# Altium project att.PrjPcb
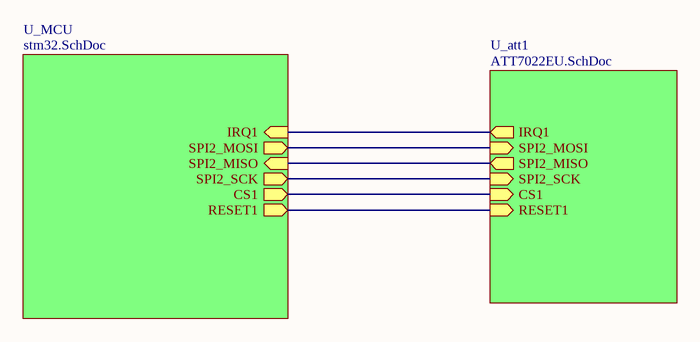
[diagram p0: maseter.SchDoc]
3 sheets, 58 parts. Net scope: hierarchical (ports join the sheet entries above them; power ports are global).
Board file: PCB1.PcbDoc
Sheets:
  maseter.SchDoc
    U_MCU = stm32.SchDoc
    U_att1 = ATT7022EU.SchDoc

## Sheet maseter.SchDoc
size A4

### Sub-sheets
U_att1 = ATT7022EU.SchDoc: IRQ1 (out), SPI2_MOSI (in), SPI2_MISO (out), SPI2_SCK (in), CS1 (in), RESET1 (in)
U_MCU = stm32.SchDoc: SPI2_MOSI (out), SPI2_SCK (out), RESET1 (out), SPI2_MISO (in), IRQ1 (in), CS1 (out)

### Nets
CS2: sheet U_MCU/CS1, sheet U_att1/CS1
DIN: sheet U_MCU/SPI2_MOSI, sheet U_att1/SPI2_MOSI
DOUT: sheet U_MCU/SPI2_MISO, sheet U_att1/SPI2_MISO
IRQ1: sheet U_MCU/IRQ1, sheet U_att1/IRQ1
RESET1: sheet U_MCU/RESET1, sheet U_att1/RESET1
SCLK: sheet U_MCU/SPI2_SCK, sheet U_att1/SPI2_SCK

## Sheet stm32.SchDoc
size A4
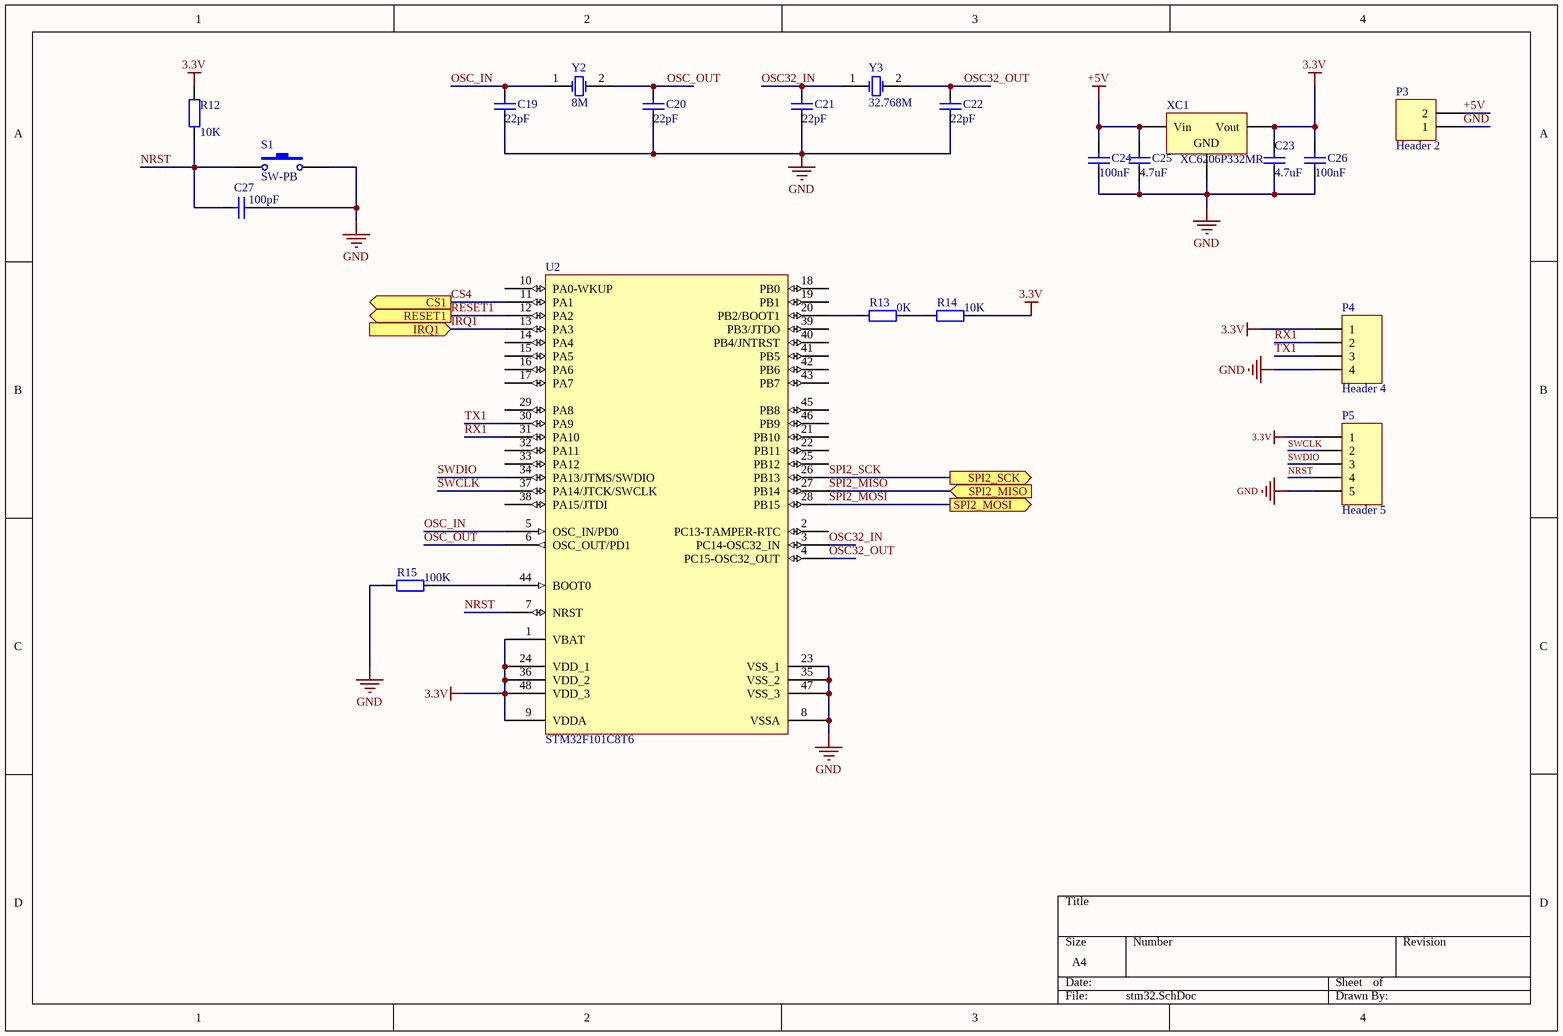
[diagram p1: stm32.SchDoc]

### Parts
C19  value 22pF  [1608[0603]]  (hidden comment: Cap Semi)
C20  value 22pF  [1608[0603]]  (hidden comment: Cap Semi)
C21  value 22pF  [1608[0603]]  (hidden comment: Cap Semi)
C22  value 22pF  [1608[0603]]  (hidden comment: Cap Semi)
C23  value 4.7uF  [1608[0603]]  (hidden comment: Cap Semi)
C24  value 100nF  [1608[0603]]  (hidden comment: Cap Semi)
C25  value 4.7uF  [1608[0603]]  (hidden comment: Cap Semi)
C26  value 100nF  [1608[0603]]  (hidden comment: Cap Semi)
C27  value 100pF  [1608[0603]]  (hidden comment: Cap Semi)
P3  Header 2  [HDR1X2]
P4  Header 4  [HDR1X4]
P5  Header 5  [HDR1X5]
R12  value 10K  [1608[0603]]  (hidden comment: Res2)
R13  value 0K  [1608[0603]]  (hidden comment: Res2)
R14  value 10K  [1608[0603]]  (hidden comment: Res2)
R15  value 100K  [AXIAL-0.4]  (hidden comment: Res2)
S1  SW-PB  [SPST-2]
U2  STM32F101C8T6  [LQFP48_N]
XC1  XC6206P332MR  [SOT89L]
Y2  8M  [HC-48SMD]
Y3  32.768M  [FC135]

### Ports
CS1 (out), IRQ1 (in), RESET1 (out), SPI2_MISO (in), SPI2_MOSI (out), SPI2_SCK (out)

### Nets
3.3V: C23.2 C26.2 P4.1 P5.1 R12.1 R14.2 U2.1(VBAT) U2.9(VDDA) U2.24(VDD_1) U2.36(VDD_2) U2.48(VDD_3) XC1.3(Vout)
+5V: C24.2 C25.2 P3.2 XC1.1(Vin)
GND: C19.1 C20.1 C21.1 C22.1 C23.1 C24.1 C25.1 C26.1 C27.2 P3.1 P4.4 P5.5 R15.1 S1.2 U2.8(VSSA) U2.23(VSS_1) U2.35(VSS_2) U2.47(VSS_3) XC1.2(GND)
CS4: U2.11(PA1) ; port CS1  [project net CS2]
IRQ1: U2.13(PA3) ; port IRQ1
NRST: C27.1 P5.4 R12.2 S1.1 U2.7(NRST)
OSC32_IN: C21.2 U2.3(PC14-OSC32_IN) Y3.1(OSC1)
OSC32_OUT: C22.2 U2.4(PC15-OSC32_OUT) Y3.2(OSC2)
OSC_IN: C19.2 U2.5(OSC_IN/PD0) Y2.1(OSC1)
OSC_OUT: C20.2 U2.6(OSC_OUT/PD1) Y2.2(OSC2)
RESET1: U2.12(PA2) ; port RESET1
RX1: P4.2 U2.31(PA10)
SPI2_MISO: U2.27(PB14) ; port SPI2_MISO  [project net DOUT]
SPI2_MOSI: U2.28(PB15) ; port SPI2_MOSI  [project net DIN]
SPI2_SCK: U2.26(PB13) ; port SPI2_SCK  [project net SCLK]
SWCLK: P5.2 U2.37(PA14/JTCK/SWCLK)
SWDIO: P5.3 U2.34(PA13/JTMS/SWDIO)
TX1: P4.3 U2.30(PA9)
NetR13_1: R13.1 U2.20(PB2/BOOT1)
NetR13_2: R13.2 R14.1
NetR15_2: R15.2 U2.44(BOOT0)

Not connected (* = marked no-connect by the designer): U2 2(PC13-TAMPER-RTC) 10(PA0-WKUP) 14(PA4) 15(PA5) 16(PA6) 17(PA7) 18(PB0) 19(PB1) 21(PB10) 22(PB11) 25(PB12) 29(PA8) 32(PA11) 33(PA12) 38(PA15/JTDI) 39(PB3/JTDO) 40(PB4/JNTRST) 41(PB5) 42(PB6) 43(PB7) 45(PB8) 46(PB9)

### Library data of the parts
C19-C27 = Cap Semi: Capacitor (Semiconductor SIM Model); Published: 8-Jun-2000; LatestRevisionDate: 29-May-2009; LatestRevisionNote: IPC-7351 Footprint Added.; PackageReference: C1206; Publisher: Altium Limited; PackageDescription: Chip Capacitor
P3 = Header 2: Header, 2-Pin; LatestRevisionDate: 17-Jul-2002; LatestRevisionNote: Re-released for DXP Platform.; Publisher: Altium Limited
P4 = Header 4: Header, 4-Pin; LatestRevisionDate: 17-Jul-2002; LatestRevisionNote: Re-released for DXP Platform.; Publisher: Altium Limited
P5 = Header 5: Header, 5-Pin; LatestRevisionDate: 17-Jul-2002; LatestRevisionNote: Re-released for DXP Platform.; Publisher: Altium Limited
R12-R15 = Res2: Resistor; Published: 8-Jun-2000; LatestRevisionDate: 17-Jul-2002; LatestRevisionNote: Re-released for DXP Platform.; PackageReference: AXIAL-0.4; Publisher: Altium Limited; PackageDescription: Axial Device, Thru-Hole; 2 Leads; 0.4 in Pin Spacing
S1 = SW-PB: Switch; Published: 24-Mar-1999; LatestRevisionDate: 17-Jul-2002; LatestRevisionNote: Re-released for DXP Platform.; PackageReference: SPST-2; Publisher: Altium Limited; PackageDescription: Switch; 2 Leads
U2 = STM32F101C8T6: STM32 ARM-based 32-bit MCU with 64 Kbytes Flash, 48-pin LQFP, Industrial Temperature; Published: 30-May-2008; DatasheetVersion: rev6, Mar-2008; PackageVersion: Mar-2008; PackageReference: LQFP48; Publisher: Altium Limited; PackageDescription: 48-Pin Low-Profile Quad Flat Pack, 7 x 7 mm Body, 0.5 mm Pitch (LQFP48); ComponentLink1Description: Manufacturer Link; ComponentLink1URL: www.st.com/stm32; ComponentLink2Description: Datasheet; ComponentLink2URL: http://www.st.com/stonline/products/literature/ds/13586.pdf
XC1 = Volt Reg: Voltage Regulator; Published: 24-Mar-1999; LatestRevisionDate: 29-May-2009; LatestRevisionNote: IPC-7351 Footprint Added.; PackageReference: D2PAK; Publisher: Altium Limited; PackageDescription: 3-Pin Transistor Outline Package 2.54 mm Pitch, 15.1 mm Lead Span
Y2 Y3 = XTAL: Crystal Oscillator; Published: 8-Jun-2000; LatestRevisionDate: 17-Jul-2002; LatestRevisionNote: Re-released for DXP Platform.; PackageReference: R38; Publisher: Altium Limited; PackageDescription: Crystal, Thru-Hole; 2 Leads; Body 3.1 x 8.2 mm (Dia.xH)

## Sheet ATT7022EU.SchDoc
size A4
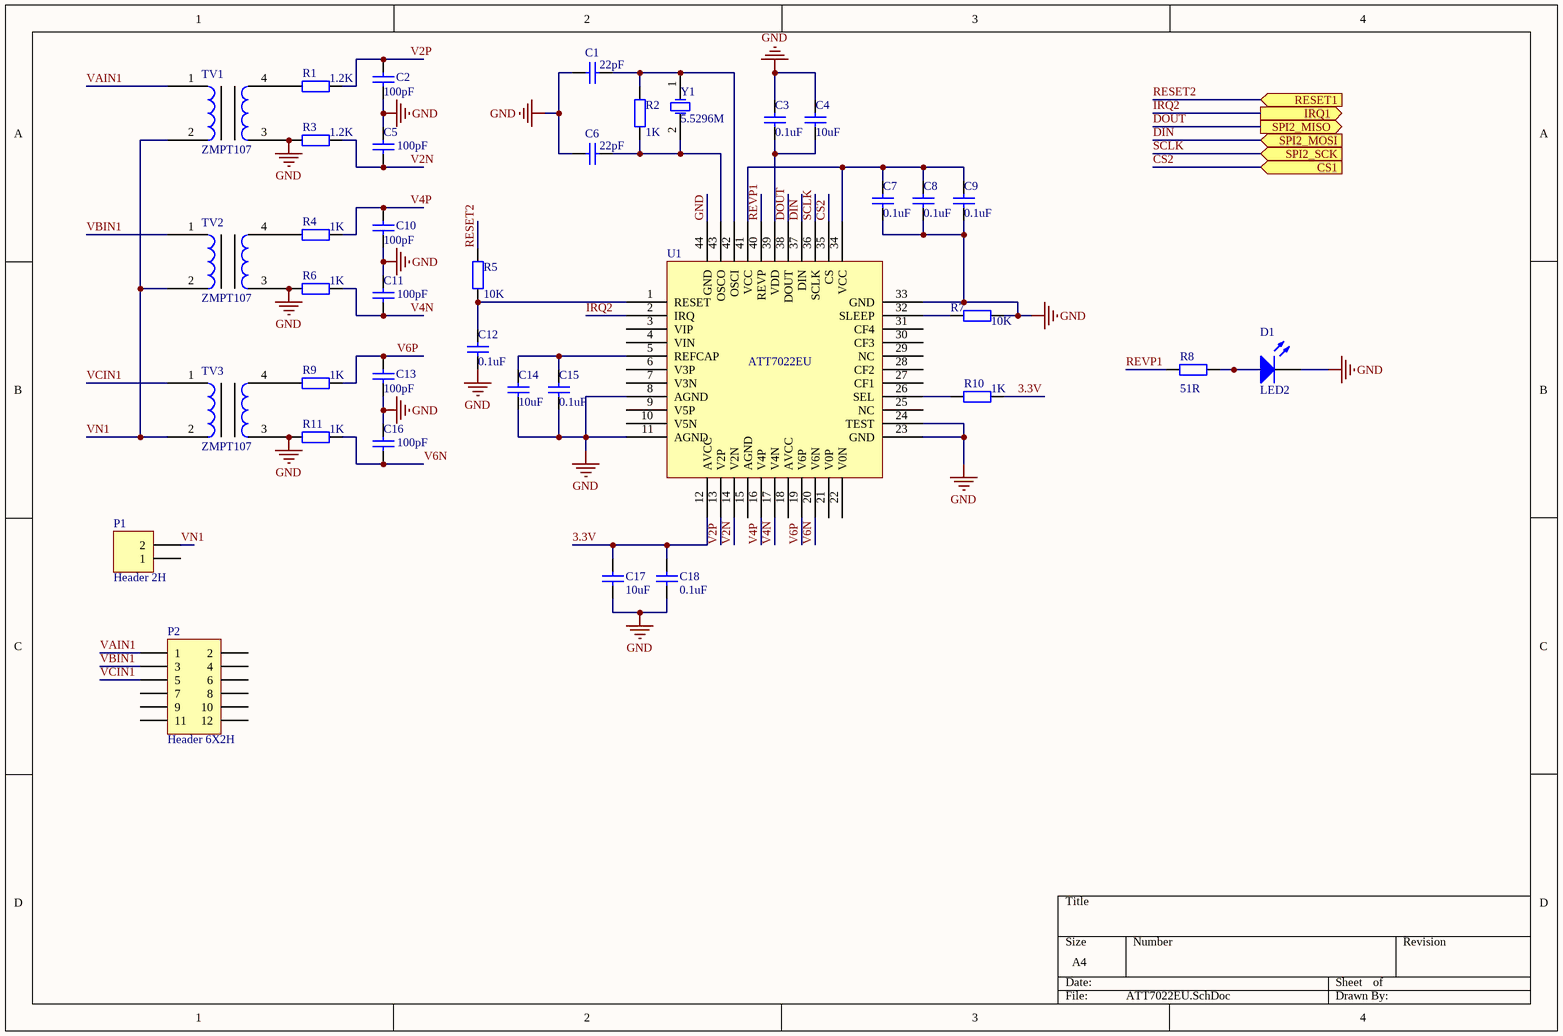
[diagram p2: ATT7022EU.SchDoc]

### Parts
C1  value 22pF  [C1206]  (hidden comment: Cap Semi)
C2  value 100pF  [RAD-0.3]  (hidden comment: Cap)
C3  value 0.1uF  [RAD-0.3]  (hidden comment: Cap)
C4  value 10uF  [RAD-0.3]  (hidden comment: Cap)
C5  value 100pF  [RAD-0.3]  (hidden comment: Cap)
C6  value 22pF  [C1206]  (hidden comment: Cap Semi)
C7  value 0.1uF  [RAD-0.3]  (hidden comment: Cap)
C8  value 0.1uF  [RAD-0.3]  (hidden comment: Cap)
C9  value 0.1uF  [RAD-0.3]  (hidden comment: Cap)
C10  value 100pF  [RAD-0.3]  (hidden comment: Cap)
C11  value 100pF  [RAD-0.3]  (hidden comment: Cap)
C12  value 0.1uF  [RAD-0.3]  (hidden comment: Cap)
C13  value 100pF  [RAD-0.3]  (hidden comment: Cap)
C14  value 10uF  [RAD-0.3]  (hidden comment: Cap)
C15  value 0.1uF  [RAD-0.3]  (hidden comment: Cap)
C16  value 100pF  [RAD-0.3]  (hidden comment: Cap)
C17  value 10uF  [RAD-0.3]  (hidden comment: Cap)
C18  value 0.1uF  [RAD-0.3]  (hidden comment: Cap)
D1  LED2  [3.2X1.6X1.1]
P1  Header 2H  [HDR1X2H]
P2  Header 6X2H  [HDR2X6H]
R1  value 1.2K  [AXIAL-0.4]  (hidden comment: Res2)
R2  value 1K  [AXIAL-0.4]  (hidden comment: Res2)
R3  value 1.2K  [AXIAL-0.4]  (hidden comment: Res2)
R4  value 1K  [AXIAL-0.4]  (hidden comment: Res2)
R5  value 10K  [AXIAL-0.4]  (hidden comment: Res2)
R6  value 1K  [AXIAL-0.4]  (hidden comment: Res2)
R7  value 10K  [AXIAL-0.4]  (hidden comment: Res2)
R8  value 51R  [AXIAL-0.4]  (hidden comment: Res2)
R9  value 1K  [AXIAL-0.4]  (hidden comment: Res2)
R10  value 1K  [AXIAL-0.4]  (hidden comment: Res2)
R11  value 1K  [AXIAL-0.4]  (hidden comment: Res2)
TV1  ZMPT107  [ZTMP107]
TV2  ZMPT107  [ZTMP107]
TV3  ZMPT107  [ZTMP107]
U1  ATT7022EU
Y1  5.5296M  [R38]

### Ports
CS1 (in), IRQ1 (out), RESET1 (in), SPI2_MISO (out), SPI2_MOSI (in), SPI2_SCK (in)

### Nets
GND: C1.1 C2.1 C3.2 C4.1 C5.2 C6.1 C7.1 C8.1 C9.1 C10.1 C11.2 C12.1 C13.1 C14.1 C15.1 C16.2 C17.1 C18.1 D1.2(K) R3.1 R6.1 R7.2 R11.1 TV1.3 TV2.3 TV3.3 U1.8(AGND) U1.11(AGND) U1.23(GND) U1.24(TEST) U1.33(GND) U1.44(GND)
3.3V: C17.2 C18.2 R10.2 U1.12(AVCC)
CS2: U1.35(CS) ; port CS1
DIN: U1.37(DIN) ; port SPI2_MOSI
DOUT: U1.38(DOUT) ; port SPI2_MISO
IRQ2: U1.2(IRQ) ; port IRQ1  [project net IRQ1]
RESET2: R5.2 ; port RESET1  [project net RESET1]
REVP1: R8.1 U1.40(REVP)
SCLK: U1.36(SCLK) ; port SPI2_SCK
V2N: C5.1 R3.2 U1.14(V2N)
V2P: C2.2 R1.2 U1.13(V2P)
V4N: C11.1 R6.2 U1.17(V4N)
V4P: C10.2 R4.2 U1.16(V4P)
V6N: C16.1 R11.2 U1.20(V6N)
V6P: C13.2 R9.2 U1.19(V6P)
VAIN1: P2.1 TV1.1
VBIN1: P2.3 TV2.1
VCIN1: P2.5 TV3.1
VN1: P1.2 TV1.2 TV2.2 TV3.2
NetC1_2: C1.2 R2.2 U1.42(OSCI) Y1.1(OSC1)
NetC3_1: C3.1 C4.2 U1.39(VDD)
NetC6_2: C6.2 R2.1 U1.43(OSCO) Y1.2(OSC2)
NetC7_2: C7.2 C8.2 C9.2 U1.34(VCC) U1.41(VCC)
NetC12_2: C12.2 R5.1 U1.1(RESET)
NetC14_2: C14.2 C15.2 U1.5(REFCAP)
NetD1_1: D1.1(A) R8.2
NetR1_1: R1.1 TV1.4
NetR4_1: R4.1 TV2.4
NetR7_1: R7.1 U1.32(SLEEP)
NetR9_1: R9.1 TV3.4
NetR10_1: R10.1 U1.26(SEL)

Not connected (* = marked no-connect by the designer): P1 1; P2 2 4 6 7 8 9 10 11 12; U1 3(VIP) 4(VIN) 6(V3P) 7(V3N) 9(V5P) 10(V5N) 15(AGND) 18(AVCC) 21(V0P) 22(V0N) 25(NC) 27(CF1) 28(CF2) 29(NC) 30(CF3) 31(CF4)

### Library data of the parts
C1 C6 = Cap Semi: Capacitor (Semiconductor SIM Model); Published: 8-Jun-2000; LatestRevisionDate: 29-May-2009; LatestRevisionNote: IPC-7351 Footprint Added.; PackageReference: C1206; Publisher: Altium Limited; PackageDescription: Chip Capacitor
C2-C5 C7-C18 = Cap: Capacitor; Published: 8-Jun-2000; LatestRevisionDate: 17-Jul-2002; LatestRevisionNote: Re-released for DXP Platform.; PackageReference: RAD-0.3; Publisher: Altium Limited; PackageDescription: Radial Cap, Thru-Hole; 2 Leads; 0.3 in Pin Spacing
D1 = LED2: Typical RED, GREEN, YELLOW, AMBER GaAs LED; Published: 8-Jun-2000; LatestRevisionDate: 17-Jul-2002; LatestRevisionNote: Re-released for DXP Platform.; PackageVersion: Feb-2002; PackageReference: 3.2X1.6X1.1; Publisher: Altium Limited; PackageDescription: SM LED; 2 Flat Leads
P1 = Header 2H: Header, 2-Pin, Right Angle; LatestRevisionDate: 17-Jul-2002; LatestRevisionNote: Re-released for DXP Platform.; Publisher: Altium Limited
P2 = Header 6X2H: Header, 6-Pin, Dual row, Right Angle; LatestRevisionDate: 17-Jul-2002; LatestRevisionNote: Re-released for DXP Platform.; Publisher: Altium Limited
R1-R11 = Res2: Resistor; Published: 8-Jun-2000; LatestRevisionDate: 17-Jul-2002; LatestRevisionNote: Re-released for DXP Platform.; PackageReference: AXIAL-0.4; Publisher: Altium Limited; PackageDescription: Axial Device, Thru-Hole; 2 Leads; 0.4 in Pin Spacing
Y1 = XTAL: Crystal Oscillator; Published: 8-Jun-2000; LatestRevisionDate: 17-Jul-2002; LatestRevisionNote: Re-released for DXP Platform.; PackageReference: R38; Publisher: Altium Limited; PackageDescription: Crystal, Thru-Hole; 2 Leads; Body 3.1 x 8.2 mm (Dia.xH)

## Nets that join several sheets
GND: stm32 (19 pins), ATT7022EU (32 pins)
CS2: stm32 (U2.11), ATT7022EU (U1.35)
DIN: stm32 (U2.28), ATT7022EU (U1.37)
DOUT: stm32 (U2.27), ATT7022EU (U1.38)
IRQ1: stm32 (U2.13), ATT7022EU (U1.2)
RESET1: stm32 (U2.12), ATT7022EU (R5.2)
SCLK: stm32 (U2.26), ATT7022EU (U1.36)